# EAGLE schematic SCHEMAELETTRICOSCUOLA (EAGLE 9.0.0)
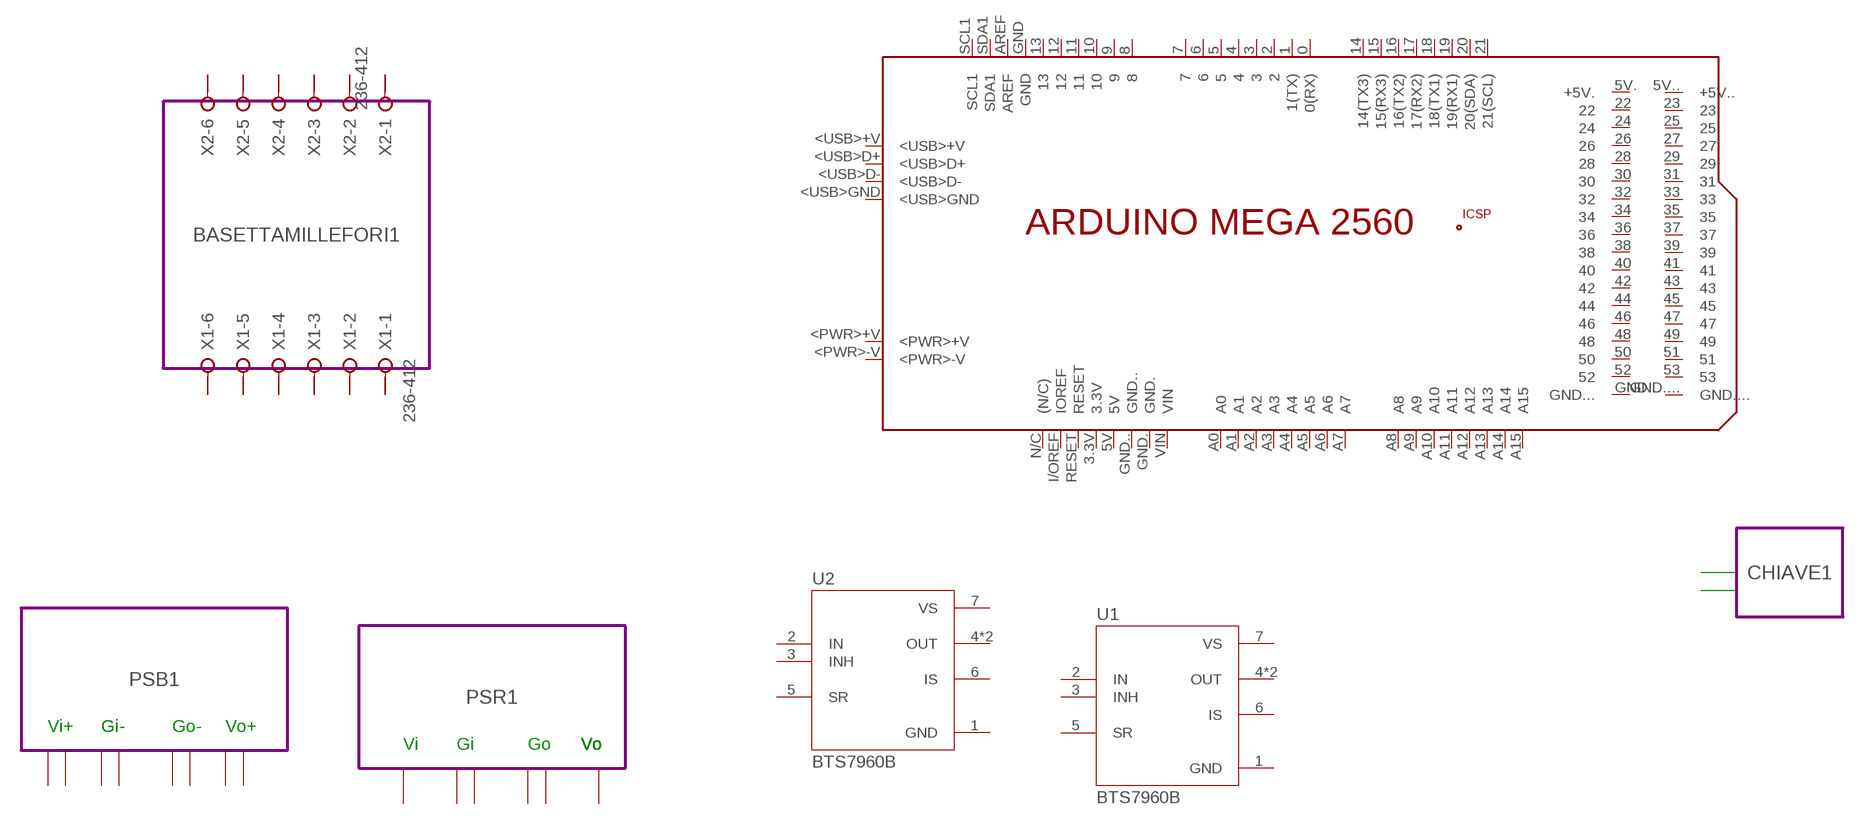
[diagram p0: schematic, sheet 1]

## Parts
PCB1  ARDUINO_MEGA2560  [ARDUINO_MEGA2560]
U1  BTS7960B  [DPAK127P1490X440-8N]
U2  BTS7960B  [DPAK127P1490X440-8N]
X1  236-412  [236-412]
X2  236-412  [236-412]

## Module instances
PSB1 = PSB
PSR1 = PSR
CHIAVE1 = CHIAVE
BASETTAMILLEFORI1 = BASETTAMILLEFORI
Unconnected: PCB1.0(0(RX)) PCB1.1(1(TX)) PCB1.2 PCB1.3 PCB1.3.3V PCB1.4 PCB1.5 PCB1.5V PCB1.5V.(+5V.) PCB1.5V..(+5V..) PCB1.6 PCB1.7 PCB1.8 PCB1.9 PCB1.10 PCB1.11 PCB1.12 PCB1.13 PCB1.14(14(TX3)) PCB1.15(15(RX3)) PCB1.16(16(TX2)) PCB1.17(17(RX2)) PCB1.18(18(TX1)) PCB1.19(19(RX1)) PCB1.20(20(SDA)) PCB1.21(21(SCL)) PCB1.22 PCB1.23 PCB1.24 PCB1.25 PCB1.26 PCB1.27 PCB1.28 PCB1.29 PCB1.30 PCB1.31 PCB1.32 PCB1.33 PCB1.34 PCB1.35 PCB1.36 PCB1.37 PCB1.38 PCB1.39 PCB1.40 PCB1.41 PCB1.42 PCB1.43 PCB1.44 PCB1.45 PCB1.46 PCB1.47 PCB1.48 PCB1.49 PCB1.50 PCB1.51 PCB1.52 PCB1.53 PCB1.+5V_ PCB1.<PWR>+V PCB1.<PWR>-V PCB1.<USB>+V PCB1.<USB>D+ PCB1.<USB>D- PCB1.<USB>GND PCB1.A0 PCB1.A1 PCB1.A2 PCB1.A3 PCB1.A4 PCB1.A5 PCB1.A6 PCB1.A7 PCB1.A8 PCB1.A9 PCB1.A10 PCB1.A11 PCB1.A12 PCB1.A13 PCB1.A14 PCB1.A15 PCB1.AREF PCB1.GND PCB1.GND. PCB1.GND.. PCB1.GND... PCB1.GND.... PCB1.GND__ PCB1.I/OREF(IOREF) PCB1.MISO PCB1.MOSI PCB1.N/C((N/C)) PCB1.RESET PCB1.RESET. PCB1.SCK PCB1.SCL1 PCB1.SDA1 PCB1.VIN U1.2(IN) U1.3(INH) U1.4(OUT) U1.5(SR) U1.6(IS) U1.8(OUT) U2.2(IN) U2.3(INH) U2.4(OUT) U2.5(SR) U2.6(IS) U2.8(OUT) X1.1@1(-1:KL1) X1.1@2(-1:KL2) X1.2@1(-2:KL1) X1.2@2(-2:KL2) X1.3@1(-3:KL1) X1.3@2(-3:KL2) X1.4@1(-4:KL1) X1.4@2(-4:KL2) X1.5@1(-5:KL1) X1.5@2(-5:KL2) X1.6@1(-6:KL1) X1.6@2(-6:KL2) X1.7@1(-7:KL1) X1.7@2(-7:KL2) X1.8@1(-8:KL1) X1.8@2(-8:KL2) X1.9@1(-9:KL1) X1.9@2(-9:KL2) X1.10@1(-10:KL1) X1.10@2(-10:KL2) X1.11@1(-11:KL1) X1.11@2(-11:KL2) X1.12@1(-12:KL1) X1.12@2(-12:KL2) X2.1@1(-1:KL1) X2.1@2(-1:KL2) X2.2@1(-2:KL1) X2.2@2(-2:KL2) X2.3@1(-3:KL1) X2.3@2(-3:KL2) X2.4@1(-4:KL1) X2.4@2(-4:KL2) X2.5@1(-5:KL1) X2.5@2(-5:KL2) X2.6@1(-6:KL1) X2.6@2(-6:KL2) X2.7@1(-7:KL1) X2.7@2(-7:KL2) X2.8@1(-8:KL1) X2.8@2(-8:KL2) X2.9@1(-9:KL1) X2.9@2(-9:KL2) X2.10@1(-10:KL1) X2.10@2(-10:KL2) X2.11@1(-11:KL1) X2.11@2(-11:KL2) X2.12@1(-12:KL1) X2.12@2(-12:KL2)

## Notes on the sheet
- Vi+ | Gi- | Gi- | Go- | Vo+
- Vi | Gi | Go | Vo | Vo | Vo | Vo

## Power pins joined to a net without a drawn wire
GND: U1.1(GND) U2.1(GND)
VS: U1.7(VS) U2.7(VS)

## Library data of the parts
PCB1 = E14_Arduino_revC:ARDUINO_MEGA2560: Device for representing an Arduino Mega 2560 board with a footprint in an EAGLE design. Created by Dave Young for Element14. More EAGLE documentation at: http://www.element14.com/community/community/knode/cadsoft_eagle
U1 U2 = BTS7960B:BTS7960B: Half Bridge Motor Driver 7-Pin(6+Tab) TO-263 Check availability <https://pricing.snapeda.com/parts/BTS7960B/Infineon/view-part?ref=eda>; AVAILABILITY: In Stock; CHECK_PRICES: https://www.snapeda.com/parts/BTS7960B/Infineon+Technologies/view-part/?ref=eda; DESCRIPTION: Half Bridge Driver DC Motors, General Purpose DMOS PG-TO263-7-1; MF: Infineon; MP: BTS7960B; PACKAGE: TO-263 Infineon; PRICE: None; SNAPEDA_LINK: https://www.snapeda.com/parts/BTS7960B/Infineon+Technologies/view-part/?ref=snap
X1 X2 = con-wago-508:236-412: Terminal Strips 2.5 mm2/AWG 12, Series 236, Pin Spacings 5/5.08 mm Source: Data sheet <http://www.farnell.com/datasheets/63479.pdf>; MF: Wago Corporation; MPN: 0236-0412; OC_FARNELL: 1283531; OC_NEWARK: 79K2064

## Module PSB
Ports: 

### Library data of the parts

## Module PSR
Ports: 

### Library data of the parts

## Module CHIAVE
Ports: 

### Library data of the parts

## Module BASETTAMILLEFORI
Ports: 

### Library data of the parts